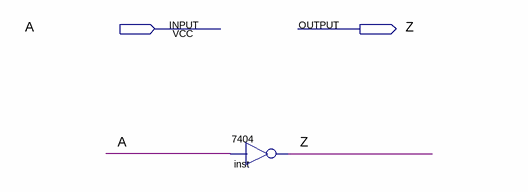
[diagram p0: schematic sheet]
// Quartus schematic not_1in.bdf as structural Verilog: 1 symbols, 2 pins
module not_1in (
  input  A,
  output Z
);

  \7404  inst (.\2 (A), .\1 (Z));
endmodule
